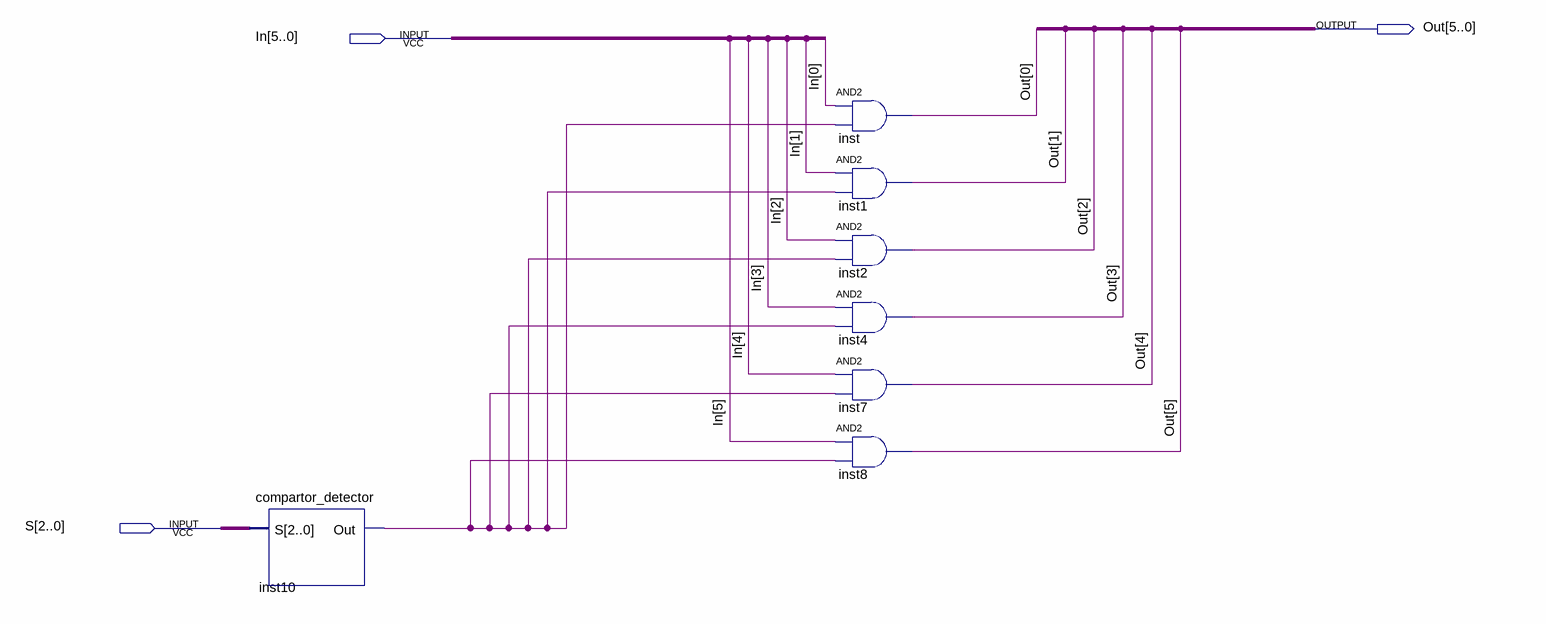
[diagram p0: schematic sheet]
// Quartus schematic LED_handler.bdf as structural Verilog: 7 symbols, 3 pins
module LED_handler (
  input  [5:0] In,
  input  [2:0] S,
  output [5:0] Out
);

  wire inst10_out;

  compartor_detector inst10 (.S(S), .Out(inst10_out));
  and inst (Out[0], In[0], inst10_out);
  and inst1 (Out[1], In[1], inst10_out);
  and inst2 (Out[2], In[2], inst10_out);
  and inst4 (Out[3], In[3], inst10_out);
  and inst7 (Out[4], In[4], inst10_out);
  and inst8 (Out[5], In[5], inst10_out);
endmodule
